# Altium project WT-32 V3.2.PrjPcb (part 4 of 4)
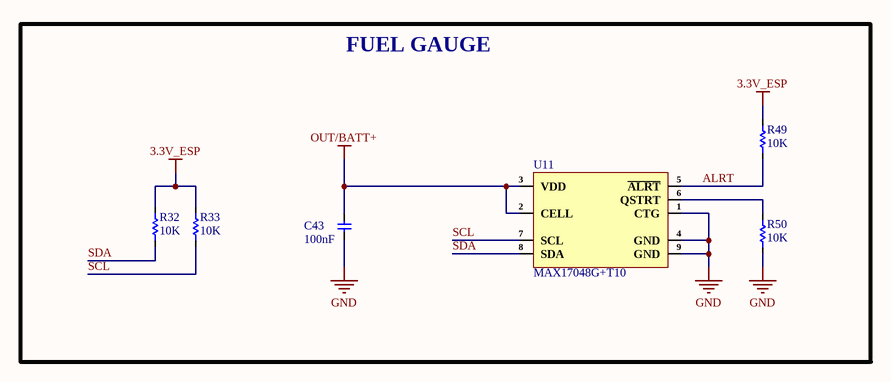
[diagram p5: FuelGauge_Sheet.SchDoc]

## Nets that join several sheets
3.3V_ESP: Power_Sheet (6 pins), Controller_Sheet (11 pins), Ethernet_Sheet (10 pins), FuelGauge_Sheet (R32.2 R33.2 R49.2)
GND: Power_Sheet (48 pins), Controller_Sheet (25 pins), Ethernet_Sheet (19 pins), FuelGauge_Sheet (5 pins)
OUT/BATT+: Power_Sheet (10 pins), FuelGauge_Sheet (C43.1 U11.2 U11.3)
ALRT: Controller_Sheet (U6.6), FuelGauge_Sheet (R49.1 U11.5)
CHG_LED: Power_Sheet (U12.2), Controller_Sheet (U6.8)
CHRG: Power_Sheet (R8.1 R11.1 U12.1), Controller_Sheet (U6.5)
ETHERNET: Power_Sheet (R15.1), Controller_Sheet (U6.14)
FULL_LED: Power_Sheet (U12.4), Controller_Sheet (U6.23)
IO0: Controller_Sheet (R30.1 SW4.2 U6.25 U7.3), Ethernet_Sheet (R38.2 U10.14)
IO4: Power_Sheet (R26.1), Controller_Sheet (U6.26)
IO13_RMII_EMAC_RX_ER: Controller_Sheet (U6.16), Ethernet_Sheet (R39.1 U10.10)
IO16_OSC_EN: Controller_Sheet (U6.27), Ethernet_Sheet (R45.1 X1.1)
IO18_RMII_MDIO: Controller_Sheet (U6.30), Ethernet_Sheet (R36.1 U10.12)
IO19_RMII_EMAC_TXD0: Controller_Sheet (U6.31), Ethernet_Sheet (U10.17)
IO21_RMII_EMAC_TX_EN: Controller_Sheet (U6.33), Ethernet_Sheet (U10.16)
IO22_RMII_EMAC_TXD1: Controller_Sheet (U6.36), Ethernet_Sheet (U10.18)
IO23_RMII_MDC: Controller_Sheet (U6.37), Ethernet_Sheet (U10.13)
IO25_RMII_EMAC_RXD0: Controller_Sheet (U6.10), Ethernet_Sheet (U10.8)
IO26_RMII_EMAC_RXD1: Controller_Sheet (U6.11), Ethernet_Sheet (U10.7)
IO27_RMII_EMAC_CRS_DV: Controller_Sheet (U6.12), Ethernet_Sheet (U10.11)
LOW BATT: Power_Sheet (R9.1), Controller_Sheet (U6.13)
SCL: Controller_Sheet (U6.29), FuelGauge_Sheet (R33.1 U11.7)
SDA: Controller_Sheet (U6.28), FuelGauge_Sheet (R32.1 U11.8)
STDBY: Power_Sheet (R6.1 R10.1 U12.3), Controller_Sheet (U6.4)
USB_N: Power_Sheet (C13.2 R22.1), Controller_Sheet (D6.2 U9.6)
USB_P: Power_Sheet (C14.2 R23.1), Controller_Sheet (D7.2 U9.5)
WIFI: Power_Sheet (R25.1), Controller_Sheet (U6.24)